# Altium schematic sheet BLOCK2.SchDoc
size A3; SheetNumber: 2; SheetTotal: 12
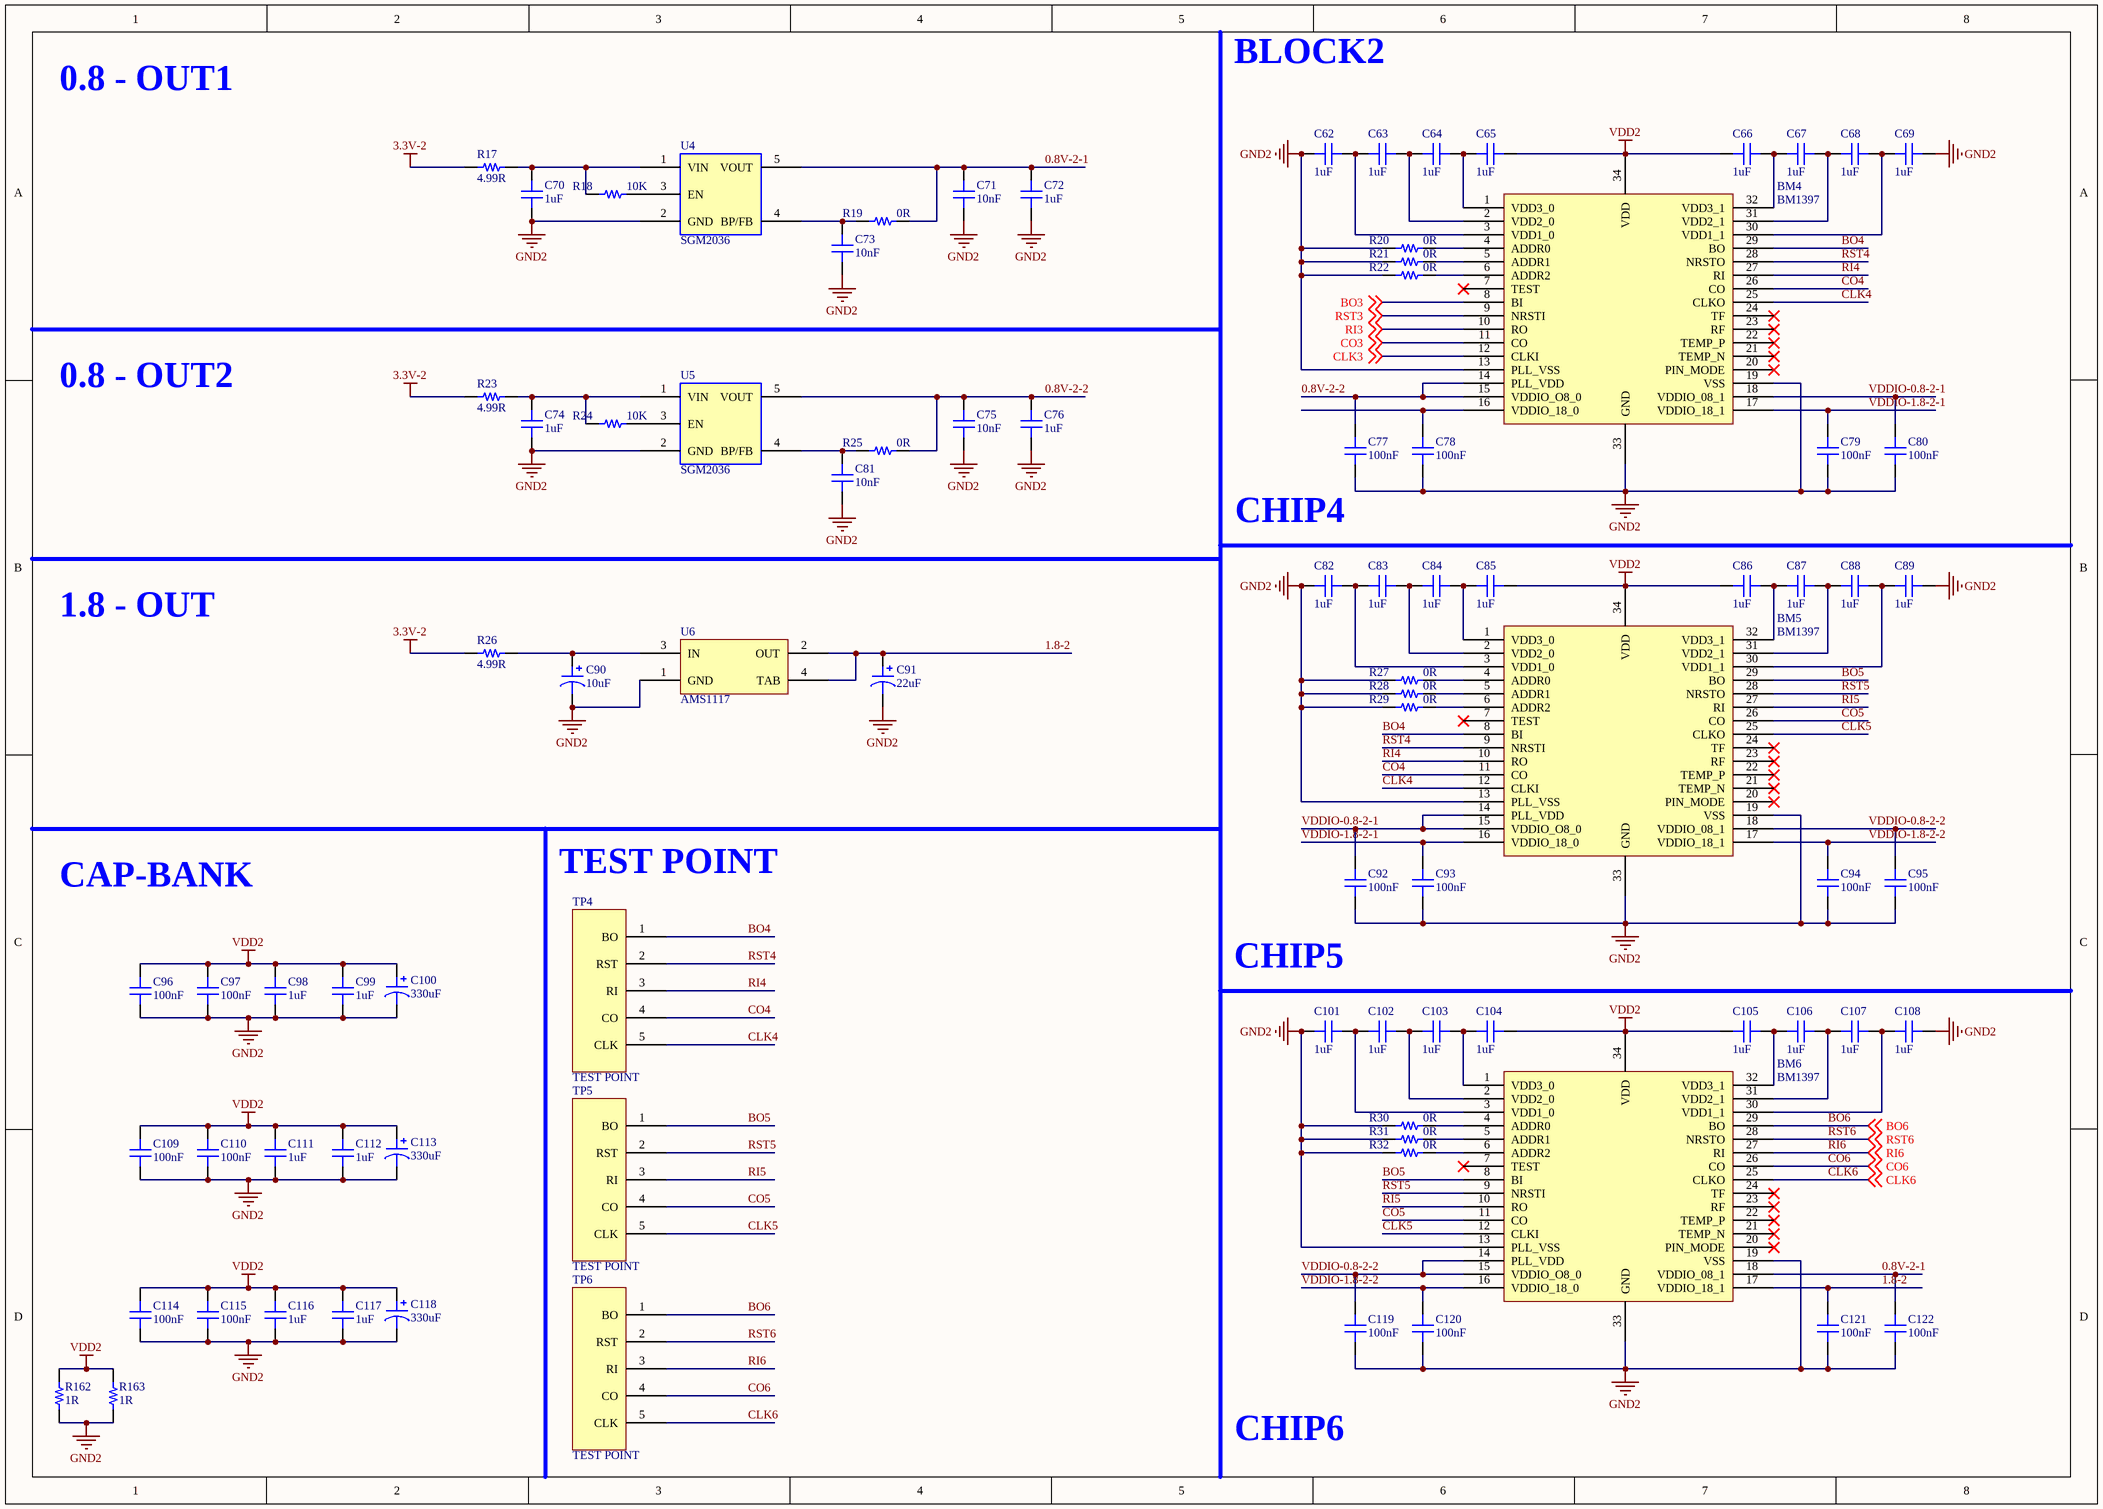
[diagram p0: BLOCK2.SchDoc]

## Parts
BM4  BM1397  [BM1387]
BM5  BM1397  [BM1387]
BM6  BM1397  [BM1387]
C62  1uF  [CAP-SMD-0603]
C63  1uF  [CAP-SMD-0603]
C64  1uF  [CAP-SMD-0603]
C65  1uF  [CAP-SMD-0603]
C66  1uF  [CAP-SMD-0603]
C67  1uF  [CAP-SMD-0603]
C68  1uF  [CAP-SMD-0603]
C69  1uF  [CAP-SMD-0603]
C70  1uF  [CAP_SMD_0805]
C71  10nF  [CAP_SMD_0805]
C72  1uF  [CAP_SMD_0805]
C73  10nF  [CAP_SMD_0805]
C74  1uF  [CAP_SMD_0805]
C75  10nF  [CAP_SMD_0805]
C76  1uF  [CAP_SMD_0805]
C77  100nF  [CAP_SMD_0805]
C78  100nF  [CAP_SMD_0805]
C79  100nF  [CAP_SMD_0805]
C80  100nF  [CAP_SMD_0805]
C81  10nF  [CAP_SMD_0805]
C82  1uF  [CAP-SMD-0603]
C83  1uF  [CAP-SMD-0603]
C84  1uF  [CAP-SMD-0603]
C85  1uF  [CAP-SMD-0603]
C86  1uF  [CAP-SMD-0603]
C87  1uF  [CAP-SMD-0603]
C88  1uF  [CAP-SMD-0603]
C89  1uF  [CAP-SMD-0603]
C90  10uF  [CAP-TAN-CASE-A]
C91  22uF  [CAP-TAN-CASE-A]
C92  100nF  [CAP_SMD_0805]
C93  100nF  [CAP_SMD_0805]
C94  100nF  [CAP_SMD_0805]
C95  100nF  [CAP_SMD_0805]
C96  100nF  [CAP_SMD_0805]
C97  100nF  [CAP_SMD_0805]
C98  1uF  [CAP_SMD_0805]
C99  1uF  [CAP_SMD_0805]
C100  330uF  [CAP-TAN-CASE-E]
C101  1uF  [CAP-SMD-0603]
C102  1uF  [CAP-SMD-0603]
C103  1uF  [CAP-SMD-0603]
C104  1uF  [CAP-SMD-0603]
C105  1uF  [CAP-SMD-0603]
C106  1uF  [CAP-SMD-0603]
C107  1uF  [CAP-SMD-0603]
C108  1uF  [CAP-SMD-0603]
C109  100nF  [CAP_SMD_0805]
C110  100nF  [CAP_SMD_0805]
C111  1uF  [CAP_SMD_0805]
C112  1uF  [CAP_SMD_0805]
C113  330uF  [CAP-TAN-CASE-E]
C114  100nF  [CAP_SMD_0805]
C115  100nF  [CAP_SMD_0805]
C116  1uF  [CAP_SMD_0805]
C117  1uF  [CAP_SMD_0805]
C118  330uF  [CAP-TAN-CASE-E]
C119  100nF  [CAP_SMD_0805]
C120  100nF  [CAP_SMD_0805]
C121  100nF  [CAP_SMD_0805]
C122  100nF  [CAP_SMD_0805]
R17  4.99R  [RES-SMD-1206]
R18  10K  [RES-SMD-0402]
R19  0R  [RES-SMD-0402]
R20  0R  [RES-SMD-0402]
R21  0R  [RES-SMD-0402]
R22  0R  [RES-SMD-0402]
R23  4.99R  [RES-SMD-1206]
R24  10K  [RES-SMD-0402]
R25  0R  [RES-SMD-0402]
R26  4.99R  [RES-SMD-1206]
R27  0R  [RES-SMD-0402]
R28  0R  [RES-SMD-0402]
R29  0R  [RES-SMD-0402]
R30  0R  [RES-SMD-0402]
R31  0R  [RES-SMD-0402]
R32  0R  [RES-SMD-0402]
R162  1R  [RES-SMD-1210]
R163  1R  [RES-SMD-1210]
TP4  TEST POINT  [TEST_POINT]
TP5  TEST POINT  [TEST_POINT]
TP6  TEST POINT  [TEST_POINT]
U4  SGM2036  [SOT23-5PIN]
U5  SGM2036  [SOT23-5PIN]
U6  AMS1117  [AMS1117]

## Nets
3.3V-2: R17.1 R23.1 R26.1
GND2: BM4.13(PLL_VSS) BM4.19(VSS) BM4.33(GND) BM5.13(PLL_VSS) BM5.19(VSS) BM5.33(GND) BM6.13(PLL_VSS) BM6.19(VSS) BM6.33(GND) C62.1 C69.2 C70.1 C71.1 C72.1 C73.1 C74.1 C75.1 C76.1 C77.1 C78.1 C79.1 C80.1 C81.1 C82.1 C89.2 C90.2 C91.2 C92.1 C93.1 C94.1 C95.1 C96.1 C97.1 C98.1 C99.1 C100.2 C101.1 C108.2 C109.1 C110.1 C111.1 C112.1 C113.2 C114.1 C115.1 C116.1 C117.1 C118.2 C119.1 C120.1 C121.1 C122.1 R20.1 R21.1 R22.1 R27.1 R28.1 R29.1 R30.1 R31.1 R32.1 R162.1 R163.1 U4.2(GND) U5.2(GND) U6.1(GND)
VDD2: BM4.34(VDD) BM5.34(VDD) BM6.34(VDD) C65.2 C66.1 C85.2 C86.1 C96.2 C97.2 C98.2 C99.2 C100.1 C104.2 C105.1 C109.2 C110.2 C111.2 C112.2 C113.1 C114.2 C115.2 C116.2 C117.2 C118.1 R162.2 R163.2
0.8V-2-1: BM6.18(VDDIO_08_1) C71.2 C72.2 C122.2 R19.2 U4.5(VOUT)
0.8V-2-2: BM4.14(PLL_VDD) BM4.15(VDDIO_O8_0) C75.2 C76.2 C77.2 R25.2 U5.5(VOUT)
1.8-2: BM6.17(VDDIO_18_1) C91.1 C121.2 U6.2(OUT) U6.4(TAB)
BO3: BM4.8(BI) ; off-sheet BO3
BO4: BM4.29(BO) BM5.8(BI) TP4.1(BO)
BO5: BM5.29(BO) BM6.8(BI) TP5.1(BO)
BO6: BM6.29(BO) TP6.1(BO) ; off-sheet BO6
CLK3: BM4.12(CLKI) ; off-sheet CLK3
CLK4: BM4.25(CLKO) BM5.12(CLKI) TP4.5(CLK)
CLK5: BM5.25(CLKO) BM6.12(CLKI) TP5.5(CLK)
CLK6: BM6.25(CLKO) TP6.5(CLK) ; off-sheet CLK6
CO3: BM4.11(CO) ; off-sheet CO3
CO4: BM4.26(CO) BM5.11(CO) TP4.4(CO)
CO5: BM5.26(CO) BM6.11(CO) TP5.4(CO)
CO6: BM6.26(CO) TP6.4(CO) ; off-sheet CO6
RI3: BM4.10(RO) ; off-sheet RI3
RI4: BM4.27(RI) BM5.10(RO) TP4.3(RI)
RI5: BM5.27(RI) BM6.10(RO) TP5.3(RI)
RI6: BM6.27(RI) TP6.3(RI) ; off-sheet RI6
RST3: BM4.9(NRSTI) ; off-sheet RST3
RST4: BM4.28(NRSTO) BM5.9(NRSTI) TP4.2(RST)
RST5: BM5.28(NRSTO) BM6.9(NRSTI) TP5.2(RST)
RST6: BM6.28(NRSTO) TP6.2(RST) ; off-sheet RST6
VDDIO-0.8-2-1: BM4.18(VDDIO_08_1) BM5.14(PLL_VDD) BM5.15(VDDIO_O8_0) C80.2 C92.2
VDDIO-0.8-2-2: BM5.18(VDDIO_08_1) BM6.14(PLL_VDD) BM6.15(VDDIO_O8_0) C95.2 C119.2
VDDIO-1.8-2-1: BM4.17(VDDIO_18_1) BM5.16(VDDIO_18_0) C79.2 C93.2
VDDIO-1.8-2-2: BM5.17(VDDIO_18_1) BM6.16(VDDIO_18_0) C94.2 C120.2
NetBM4_1: BM4.1(VDD3_0) C64.2 C65.1
NetBM4_2: BM4.2(VDD2_0) C63.2 C64.1
NetBM4_3: BM4.3(VDD1_0) C62.2 C63.1
NetBM4_4: BM4.4(ADDR0) R20.2
NetBM4_5: BM4.5(ADDR1) R21.2
NetBM4_6: BM4.6(ADDR2) R22.2
NetBM4_16: BM4.16(VDDIO_18_0) C78.2
NetBM4_30: BM4.30(VDD1_1) C68.2 C69.1
NetBM4_31: BM4.31(VDD2_1) C67.2 C68.1
NetBM4_32: BM4.32(VDD3_1) C66.2 C67.1
NetBM5_1: BM5.1(VDD3_0) C84.2 C85.1
NetBM5_2: BM5.2(VDD2_0) C83.2 C84.1
NetBM5_3: BM5.3(VDD1_0) C82.2 C83.1
NetBM5_4: BM5.4(ADDR0) R27.2
NetBM5_5: BM5.5(ADDR1) R28.2
NetBM5_6: BM5.6(ADDR2) R29.2
NetBM5_30: BM5.30(VDD1_1) C88.2 C89.1
NetBM5_31: BM5.31(VDD2_1) C87.2 C88.1
NetBM5_32: BM5.32(VDD3_1) C86.2 C87.1
NetBM6_1: BM6.1(VDD3_0) C103.2 C104.1
NetBM6_2: BM6.2(VDD2_0) C102.2 C103.1
NetBM6_3: BM6.3(VDD1_0) C101.2 C102.1
NetBM6_4: BM6.4(ADDR0) R30.2
NetBM6_5: BM6.5(ADDR1) R31.2
NetBM6_6: BM6.6(ADDR2) R32.2
NetBM6_30: BM6.30(VDD1_1) C107.2 C108.1
NetBM6_31: BM6.31(VDD2_1) C106.2 C107.1
NetBM6_32: BM6.32(VDD3_1) C105.2 C106.1
NetC70_2: C70.2 R17.2 R18.1 U4.1(VIN)
NetC73_2: C73.2 R19.1 U4.4(BP/FB)
NetC74_2: C74.2 R23.2 R24.1 U5.1(VIN)
NetC81_2: C81.2 R25.1 U5.4(BP/FB)
NetC90_1: C90.1 R26.2 U6.3(IN)
NetR18_2: R18.2 U4.3(EN)
NetR24_2: R24.2 U5.3(EN)

Not connected (* = marked no-connect by the designer): BM4 7(TEST)* 20(PIN_MODE)* 21(TEMP_N)* 22(TEMP_P)* 23(RF)* 24(TF)*; BM5 7(TEST)* 20(PIN_MODE)* 21(TEMP_N)* 22(TEMP_P)* 23(RF)* 24(TF)*; BM6 7(TEST)* 20(PIN_MODE)* 21(TEMP_N)* 22(TEMP_P)* 23(RF)* 24(TF)*

## Notes on the sheet
- 0.8 - OUT1
- BLOCK2
- 0.8 - OUT2
- CHIP4
- 1.8 - OUT
- CAP-BANK
- TEST POINT
- CHIP5
- CHIP6

## Library data of the parts
BM4-BM6 = BM1397_1
C62-C89 C92-C99 C101-C112 C114-C117 C119-C122 = CAP
C90 C91 C100 C113 C118 = POLARIZED CAP
R17-R32 R162 R163 = RES